# Altium schematic sheet PSCLK.SchDoc
size 431 x 279 mm
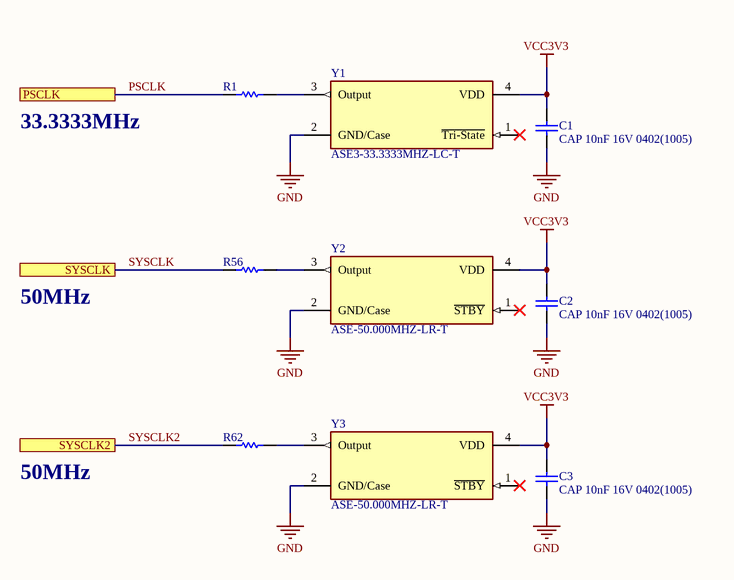
[diagram p0: PSCLK.SchDoc]

## Parts
C1  CAP 10nF 16V 0402(1005)  [CAPC0402(1005)60_M]
C2  CAP 10nF 16V 0402(1005)  [CAPC0402(1005)60_M]
C3  CAP 10nF 16V 0402(1005)  [CAPC0402(1005)60_M]
R1  ERJ2RKF33R0X  [RESC1005X40X25LL05T05]  (value not drawn)
R56  ERJ2RKF33R0X  [RESC1005X40X25LL05T05]  (value not drawn)
R62  ERJ2RKF33R0X  [RESC1005X40X25LL05T05]  (value not drawn)
Y1  ASE3-33.3333MHZ-LC-T  [FP-ASE3-MFG]
Y2  ASE-50.000MHZ-LR-T  [FP-ASE-MFG]
Y3  ASE-50.000MHZ-LR-T  [FP-ASE-MFG]

## Ports
PSCLK, SYSCLK, SYSCLK2

## Nets
GND: C1.1 C2.1 C3.1 Y1.2(GND/Case) Y2.2(GND/Case) Y3.2(GND/Case)
VCC3V3: C1.2 C2.2 C3.2 Y1.4(VDD) Y2.4(VDD) Y3.4(VDD)
PSCLK: R1.1 ; port PSCLK
SYSCLK: R56.1 ; port SYSCLK
SYSCLK2: R62.1 ; port SYSCLK2
NetR1_2: R1.2 Y1.3(Output)
NetR56_2: R56.2 Y2.3(Output)
NetR62_2: R62.2 Y3.3(Output)

Not connected (* = marked no-connect by the designer): Y1 1(~{Tri-State})*; Y2 1(~{STBY})*; Y3 1(~{STBY})*

## Notes on the sheet
- 33.3333MHz
- 50MHz
- DWG. NO.
- REV.
- SHT.
- THIS DOCUMENT AND THE DATA DISCLOSED HEREIN OR HEREWITH IS THE PROPERTY OF ALTIUM LIMITED AND MAY BE FREELY DISTRIBUTED IN WHOLE. NO RIGHTS ARE RESERVED OR EXPRESS OR IMPLIED WARANTEE GIVEN.
- REVISION
- DESCRIPTION
- DATE
- APPROVED
- ENG:
- APPROVALS
- PROJECT
- DSN:
- CHK:
- REFERENCE DOCUMENTS
- PROJECT REVISION:
- TITLE
- DOCUMENT REVISION:
- DESIGN ITEM:
- BOM:
- FAB DWG:
- PCB DWG:
- ASSY DWG:
- SCALE:
- SIZE
- B
- CAGE CODE
- FILE NAME
- DWG NO.
- SHEET
- OF
- REV

## Library data of the parts
C1-C3 = CMP-1034-01878-1: CAP 10nF 16V -20% to +80% 0402 (1005 Metric) Thickness 0.6mm SMD; Case-Metric: 1005; Case-EIA: 0402; Rated Voltage: 16 V; Max Thickness: 0.6 mm; Tolerance: -20% to +80%; Value: 10nF; Technology: SMT
R1 R56 R62 = CMP-2002-01146-1: Manufacturer: Panasonic; Part Number: ERJ2RKF33R0X
Y1 = CMP-27762-006902-1: XTAL Oscillator 33.3333MHz ±50ppm CMOS 1.8V 4-SMD 3.2mm x 2.5mm; Max Supply Current: 6mA; Max Operating Temperature: 85°C; Mount: Surface Mount; Min Operating Temperature: -40°C; Packaging: Tape and Reel; Case/Package: SMD/SMT; Frequency: 33.3333MHz; Frequency Stability: 50ppm
Y2 Y3 = CMP-27762-004169-1: XTAL Oscillator 50MHz ±25ppm CMOS 3.3V 4-SMD 3.2mm x 2.5mm; Max Supply Voltage: 3.465V; Min Supply Voltage: 3.135V; Max Supply Current: 19mA; Load Capacitance: 15pF; Width: 0.098inch; Min Operating Temperature: -40°C; Number of Pins: 4; Frequency: 50MHz; Case/Package: SMD/SMT; REACH SVHC: No SVHC; Height: 0.047inch; Frequency Stability: 25ppm; Mount: Surface Mount; Package Quantity: 1000; Operating Supply Voltage: 3.3V; Max Operating Temperature: 85°C; Packaging: Tape and Reel; Length: 0.126inch; Series: ASE